# Altium schematic sheet main.SchDoc
size A4; SheetNumber: 1; SheetTotal: 2
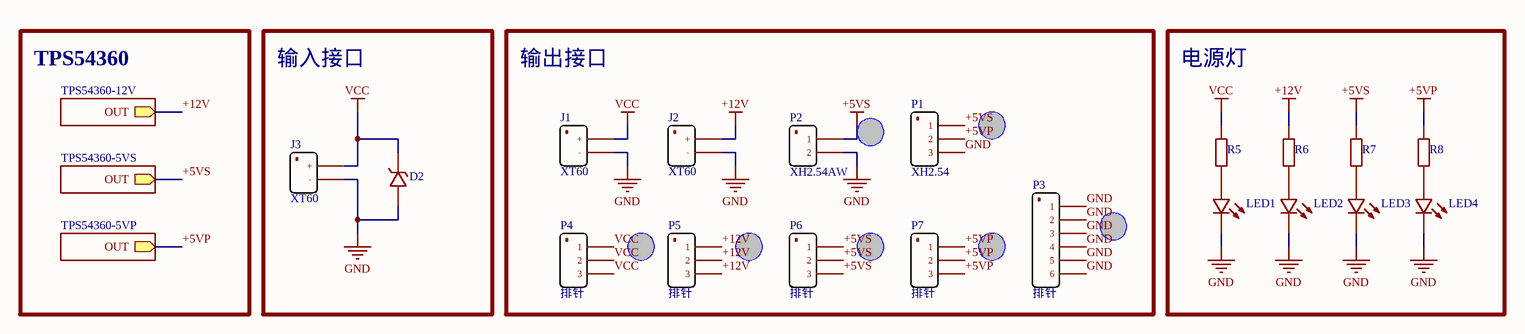
[diagram p0: main.SchDoc]

## Parts
D2  SMAJ24A  [SMA]  (value not drawn)
J1  XT60  [XT30-PW-F]
J2  XT60  [XT30-PW-F]
J3  XT60  [XT60-PT-M]
LED1  LED  [0603D]  (value not drawn)
LED2  LED  [0603D]  (value not drawn)
LED3  LED  [0603D]  (value not drawn)
LED4  LED  [0603D]  (value not drawn)
P1  XH2.54  [XH2.54_AW_1*3]
P2  XH2.54AW  [XH2.54_AW_1*2]
P3  排针  [Pin-PB-M-1*6]
P4  排针  [Pin-PB-M-1*3]
P5  排针  [Pin-PB-M-1*3]
P6  排针  [Pin-PB-M-1*3]
P7  排针  [Pin-PB-M-1*3]
R5  10K  [0603R]  (value not drawn)
R6  10K  [0603R]  (value not drawn)
R7  10K  [0603R]  (value not drawn)
R8  10K  [0603R]  (value not drawn)

## Blocks framed on the sheet
输入接口: D2 J3
输出接口: J1 J2 P1-P7
电源灯: LED1-LED4 R5-R8

## Sub-sheets
TPS54360-5VP = TPS54360.SchDoc: OUT (out)
TPS54360-5VS = TPS54360.SchDoc: OUT (out)
TPS54360-12V = TPS54360.SchDoc: OUT (out)

## Nets
+5VP: P1.2 P7.1 P7.2 P7.3 R8.2 ; sheet TPS54360-5VP/OUT
+5VS: P1.1 P2.1 P6.1 P6.2 P6.3 R7.2 ; sheet TPS54360-5VS/OUT
+12V: J2.1 P5.1 P5.2 P5.3 R6.2 ; sheet TPS54360-12V/OUT
GND: D2.1 J1.2 J2.2 J3.2 LED1.2 LED2.2 LED3.2 LED4.2 P1.3 P2.2 P3.1 P3.2 P3.3 P3.4 P3.5 P3.6
VCC: D2.2 J1.1 J3.1 P4.1 P4.2 P4.3 R5.2
NetLED1_1: LED1.1 R5.1
NetLED2_1: LED2.1 R6.1
NetLED3_1: LED3.1 R7.1
NetLED4_1: LED4.1 R8.1

## Notes on the sheet
- TPS54360
- (in symbol 接口_XT) +; -

## Library data of the parts
D2 = 二极管_瞬态抑制
J1-J3 = 接口_XT
LED1-LED4 = 二极管_贴片发光
P1 P4-P7 = 接插件1*3
P2 = 接插件1*2
P3 = 接插件1*6
R5-R8 = 电阻_贴片